# EAGLE design PROTOTYPE4 (EAGLE 8.2.2)
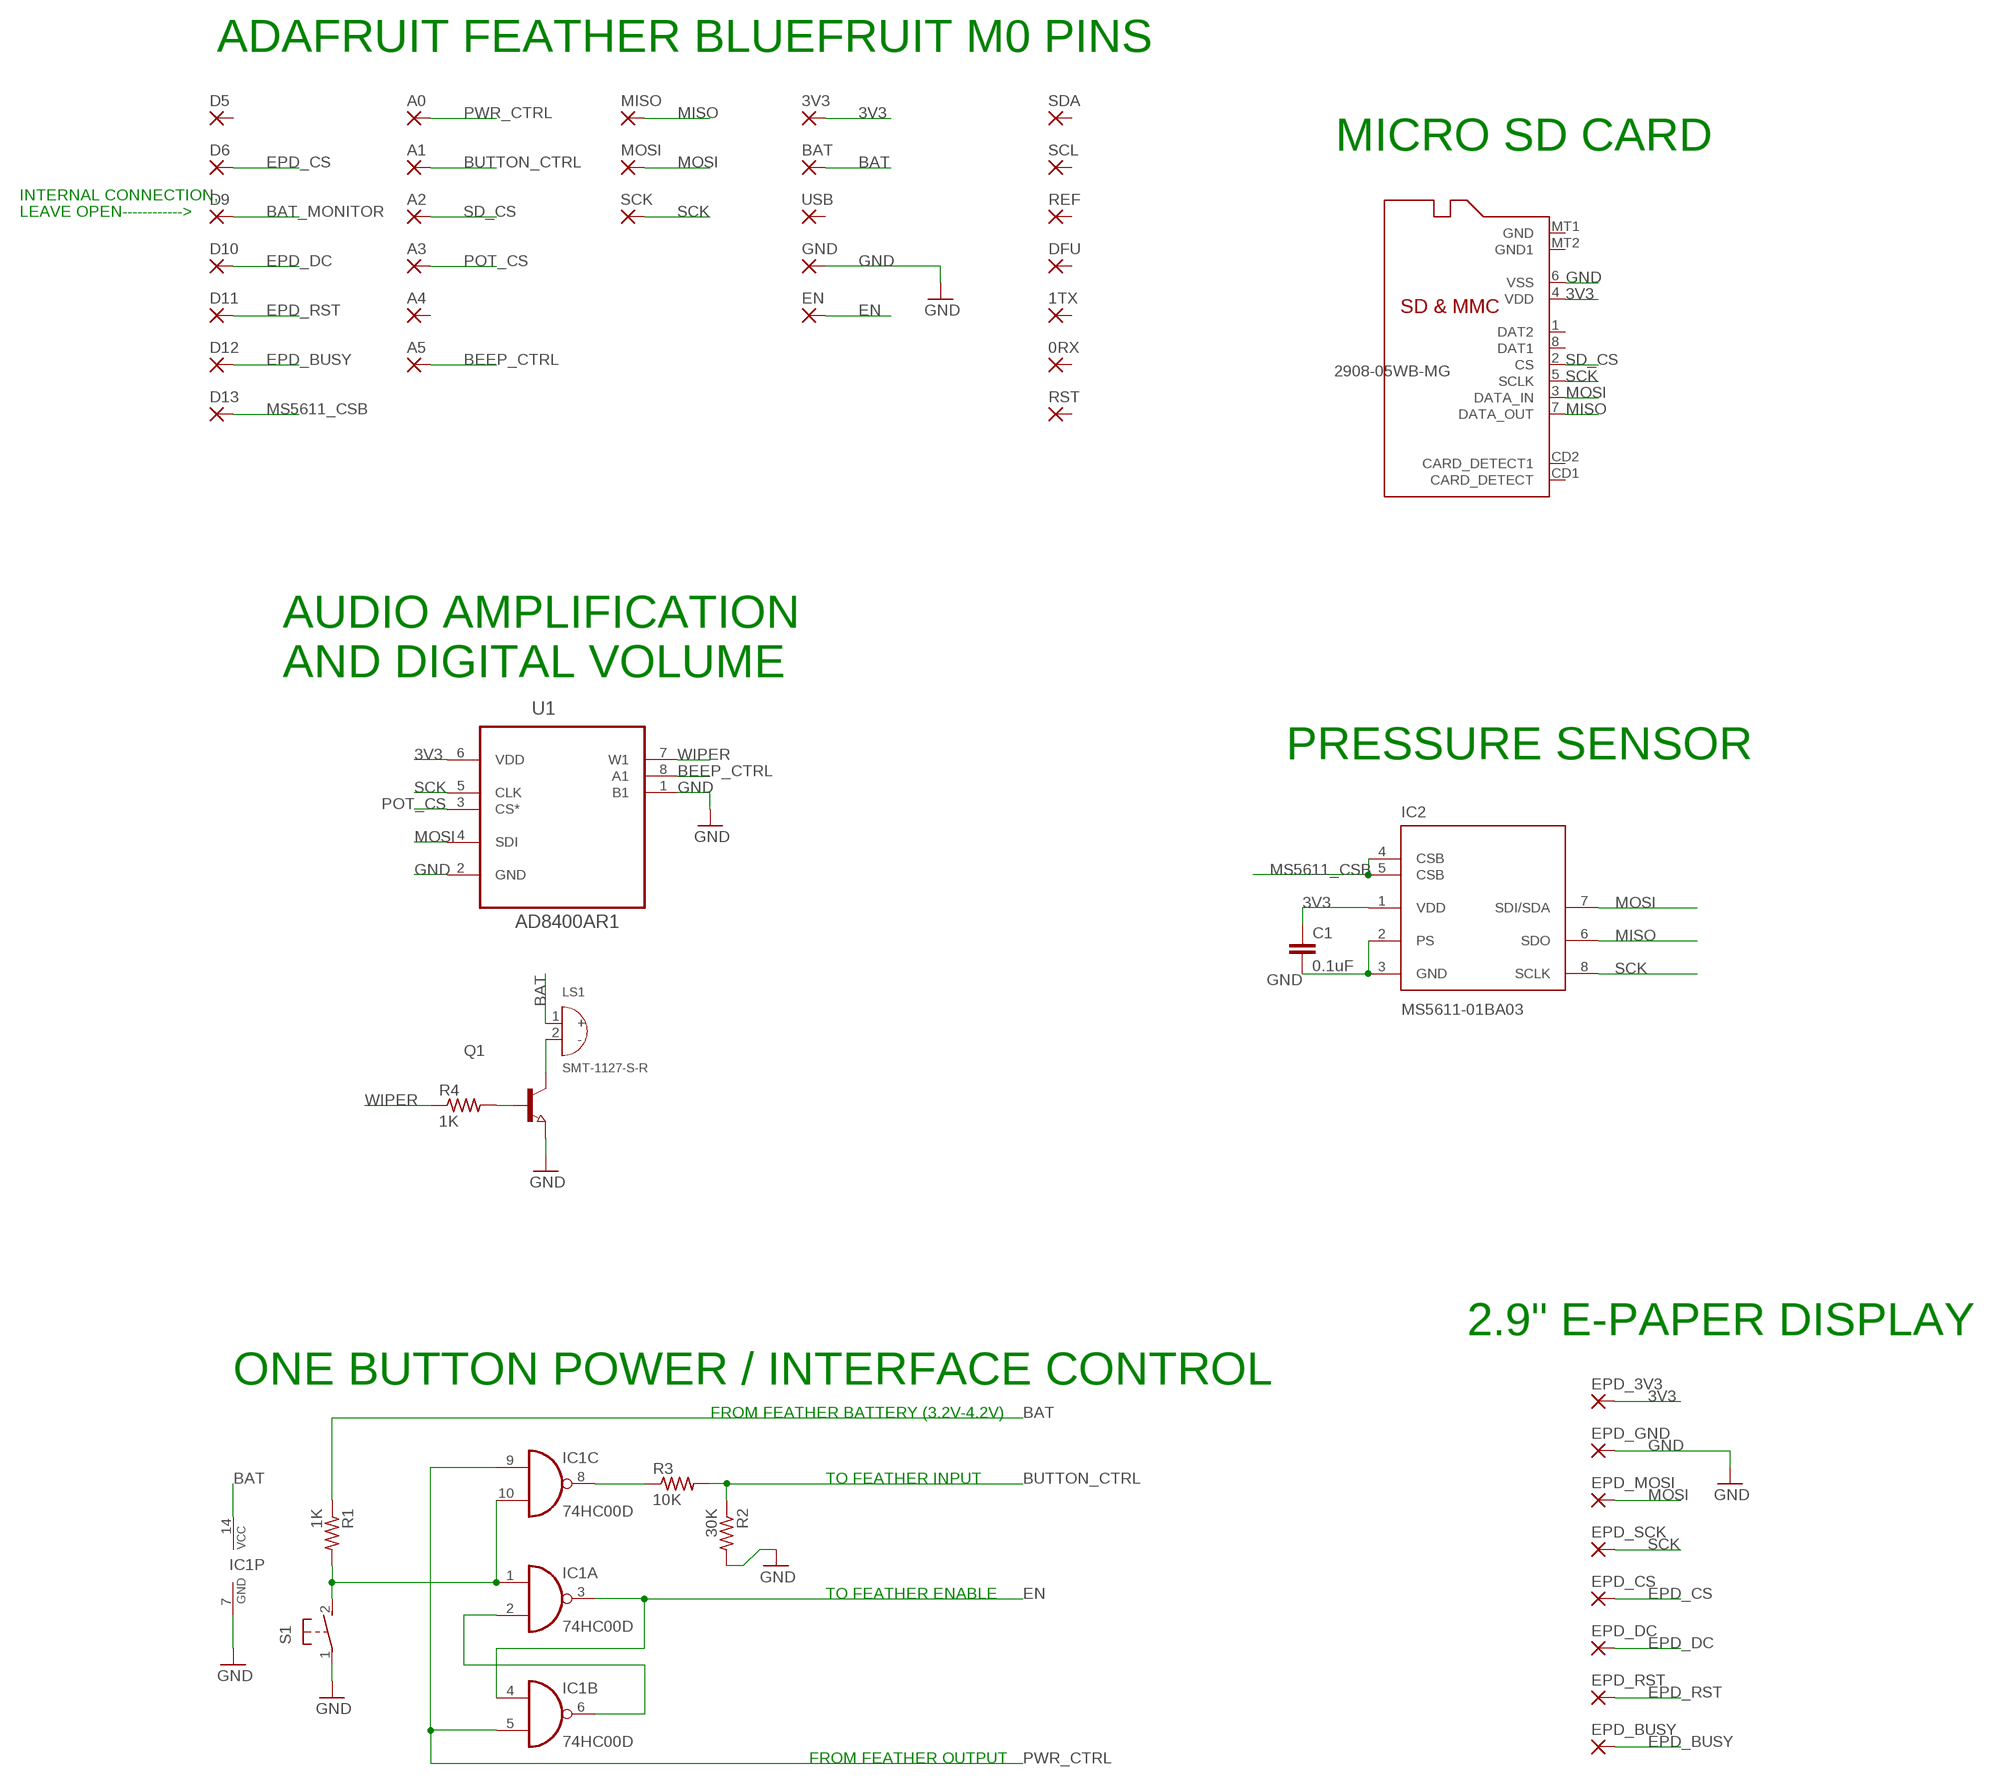
[diagram p0: schematic, sheet 1]

## Parts
0RX  SMD2  [SMD1,27-2,54]
1TX  SMD2  [SMD1,27-2,54]
3V3  SMD2  [SMD1,27-2,54]
A0  SMD2  [SMD1,27-2,54]
A1  SMD2  [SMD1,27-2,54]
A2  SMD2  [SMD1,27-2,54]
A3  SMD2  [SMD1,27-2,54]
A4  SMD2  [SMD1,27-2,54]
A5  SMD2  [SMD1,27-2,54]
BAT  SMD2  [SMD1,27-2,54]
C1  0.1uF  C-EUC0805K  [C0805K]
D5  SMD2  [SMD1,27-2,54]
D6  SMD2  [SMD1,27-2,54]
D9  SMD2  [SMD1,27-2,54]
D10  SMD2  [SMD1,27-2,54]
D11  SMD2  [SMD1,27-2,54]
D12  SMD2  [SMD1,27-2,54]
D13  SMD2  [SMD1,27-2,54]
DFU  SMD2  [SMD1,27-2,54]
EN  SMD2  [SMD1,27-2,54]
EPD_3V3  SMD2  [SMD1,27-2,54]
EPD_BUSY  SMD2  [SMD1,27-2,54]
EPD_CS  SMD2  [SMD1,27-2,54]
EPD_DC  SMD2  [SMD1,27-2,54]
EPD_GND  SMD2  [SMD1,27-2,54]
EPD_MOSI  SMD2  [SMD1,27-2,54]
EPD_RST  SMD2  [SMD1,27-2,54]
EPD_SCK  SMD2  [SMD1,27-2,54]
GND  SMD2  [SMD1,27-2,54]
IC1  74HC00D  [SO14]
IC2  MS5611-01BA03  MS5611-01BA03UNO  [SON125P300X500X100-8N]
LS1  SMT-1127-S-R  [XDCR_SMT-1127-S-R]
MISO  SMD2  [SMD1,27-2,54]
MOSI  SMD2  [SMD1,27-2,54]
Q1  NPN-TRANSISTOR_SOT23  [SOT23]
R1  1K  R-US_R0805  [R0805]
R2  30K  R-US_R0805  [R0805]
R3  10K  R-US_R0805  [R0805]
R4  1K  R-US_R0805  [R0805]
REF  SMD2  [SMD1,27-2,54]
RST  SMD2  [SMD1,27-2,54]
S1  31-XX  [B3F-31XX]
SCK  SMD2  [SMD1,27-2,54]
SCL  SMD2  [SMD1,27-2,54]
SDA  SMD2  [SMD1,27-2,54]
U1  AD8400AR1  [SOIC127P600X175-8N]
U$1  2908-05WB-MG  MICROSD  [MICROSD]
USB  SMD2  [SMD1,27-2,54]

## Nets
3V3: 3V3.1(P) C1.1 EPD_3V3.1(P) IC2.1(VDD) U1.6(VDD) U$1.4(VDD)
BAT: BAT.1(P) IC1.14(P:VCC) LS1.1(+) R1.1
BAT_MONITOR: D9.1(P)
BEEP_CTRL: A5.1(P) U1.8(A1)
BUTTON_CTRL: A1.1(P) R2.1 R3.2
EN: EN.1(P) IC1.3(A:O) IC1.4(B:I0)
EPD_BUSY: D12.1(P) EPD_BUSY.1(P)
EPD_CS: D6.1(P) EPD_CS.1(P)
EPD_DC: D10.1(P) EPD_DC.1(P)
EPD_RST: D11.1(P) EPD_RST.1(P)
GND: C1.2 EPD_GND.1(P) GND.1(P) IC1.7(P:GND) IC2.2(PS) IC2.3(GND) Q1.2(E) R2.2 S1.1(P) U1.1(B1) U1.2(GND) U$1.6(VSS)
MISO: IC2.6(SDO) MISO.1(P) U$1.7(DATA_OUT)
MOSI: EPD_MOSI.1(P) IC2.7(SDI/SDA) MOSI.1(P) U1.4(SDI) U$1.3(DATA_IN)
MS5611_CSB: D13.1(P) IC2.4(CSB) IC2.5(CSB)
N$1: IC1.1(A:I0) IC1.10(C:I1) R1.2 S1.2(S)
N$2: IC1.2(A:I1) IC1.6(B:O)
N$3: IC1.8(C:O) R3.1
N$7: Q1.1(B) R4.2
N$9: LS1.2(-) Q1.3(C)
POT_CS: A3.1(P) U1.3(CS*)
PWR_CTRL: A0.1(P) IC1.5(B:I1) IC1.9(C:I0)
SCK: EPD_SCK.1(P) IC2.8(SCLK) SCK.1(P) U1.5(CLK) U$1.5(SCLK)
SD_CS: A2.1(P) U$1.2(CS)
WIPER: R4.1 U1.7(W1)
Unconnected: 0RX.1(P) 1TX.1(P) A4.1(P) D5.1(P) DFU.1(P) IC1.11(D:O) IC1.12(D:I0) IC1.13(D:I1) REF.1(P) RST.1(P) SCL.1(P) SDA.1(P) U$1.1(DAT2) U$1.8(DAT1) U$1.CD1(CARD_DETECT) U$1.CD2(CARD_DETECT1) U$1.MT1(GND) U$1.MT2(GND1) USB.1(P)

## Notes on the sheet
- ADAFRUIT FEATHER BLUEFRUIT M0 PINS
- MICRO SD CARD
- INTERNAL CONNECTION,
- LEAVE OPEN------------>
- AUDIO AMPLIFICATION 
  AND DIGITAL VOLUME
- PRESSURE SENSOR
- 2.9" E-PAPER DISPLAY
- ONE BUTTON POWER / INTERFACE CONTROL
- FROM FEATHER BATTERY (3.2V-4.2V)
- TO FEATHER INPUT
- TO FEATHER ENABLE
- FROM FEATHER OUTPUT

## Library data of the parts
0RX 1TX 3V3 A0 A1-A5 BAT D5 D6 D9-D13 DFU EN EPD_3V3 EPD_BUSY EPD_CS EPD_DC EPD_GND EPD_MOSI EPD_RST EPD_SCK GND MISO MOSI REF RST SCK SCL SDA USB = wirepad:SMD2: SMD PAD
C1 = rcl:C-EU: CAPACITOR, European symbol
IC1 = 74xx-eu:74*00: Quad 2-input NAND gate
IC2 = Measurement-Specialties:MS5611-01BA03: Variometer Module, with stainless steel cap
LS1 = SMT-1127-S-R:SMT-1127-S-R: Audio Indicator Transducer Electromagnetic 3.6Vpk 100mA Solder Pad 2.5Vpk 2231Hz to 3231Hz Surface Mount; AVAILABILITY: Good; DESCRIPTION: Black Passive Electromagnetic SMD Buzzer 3V 80mA 2700Hz 92dB 9x3.2mm; MF: PUI Audio; MP: BOT-03D-BUJEON, SMT-1127-S-R; PACKAGE: None; PRICE: 1.43 USD
Q1 = semicon-smd-ipc:NPN-TRANSISTOR_: NPN TRANSISTOR
R1-R3 = adafruit:R-US_: RESISTOR, American symbol
R4 = resistor:R-US_: RESISTOR, American symbol
S1 = switch-omron:31-XX: OMRON SWITCH; MPN: B3F-3120; OC_FARNELL: 959704; OC_NEWARK: 36M3582
U1 = AD8400AR1:AD8400AR1: Digital Potentiometers; AVAILABILITY: Good; DESCRIPTION: Digital Potentiometer 256POS 1kOhm Single 8-Pin SOIC N Tube; MF: Analog Devices; MP: AD8400ARZ1; PACKAGE: SOIC-8 Analog Devices; PRICE: 2.43 USD
U$1 = adafruit:MICROSD: Micro-SD / Transflash card holder with SPI pinout For the 3M # 2908-05WB-MG and/or 4UCON #19656 push-push type; ACTUAL_PART_NUMBER: 2908-05WB-MG; KEEP_IN_MIND_ALTERNATE_PACKAGE: 5031821852

## Board
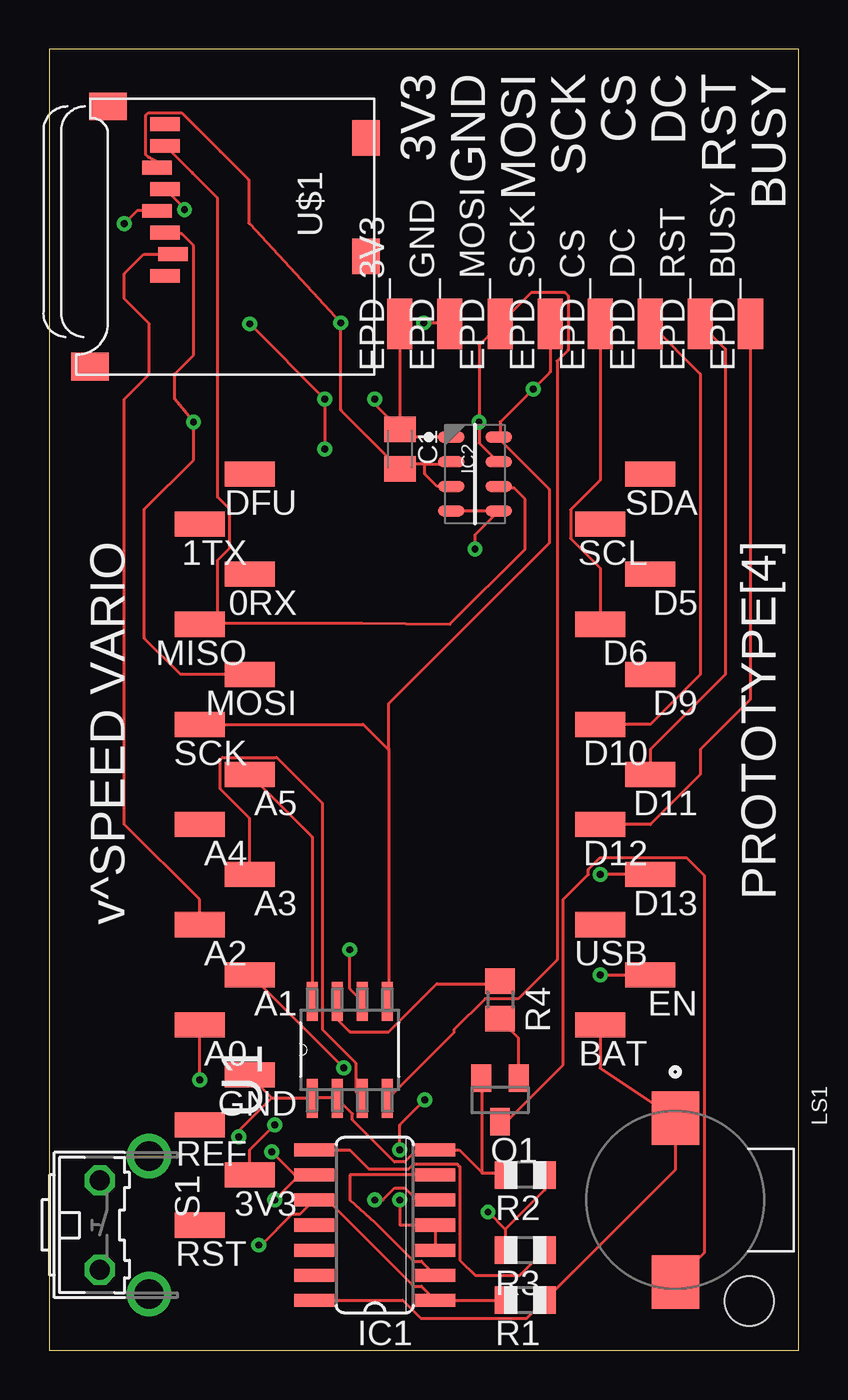
[diagram p1: board, top side]
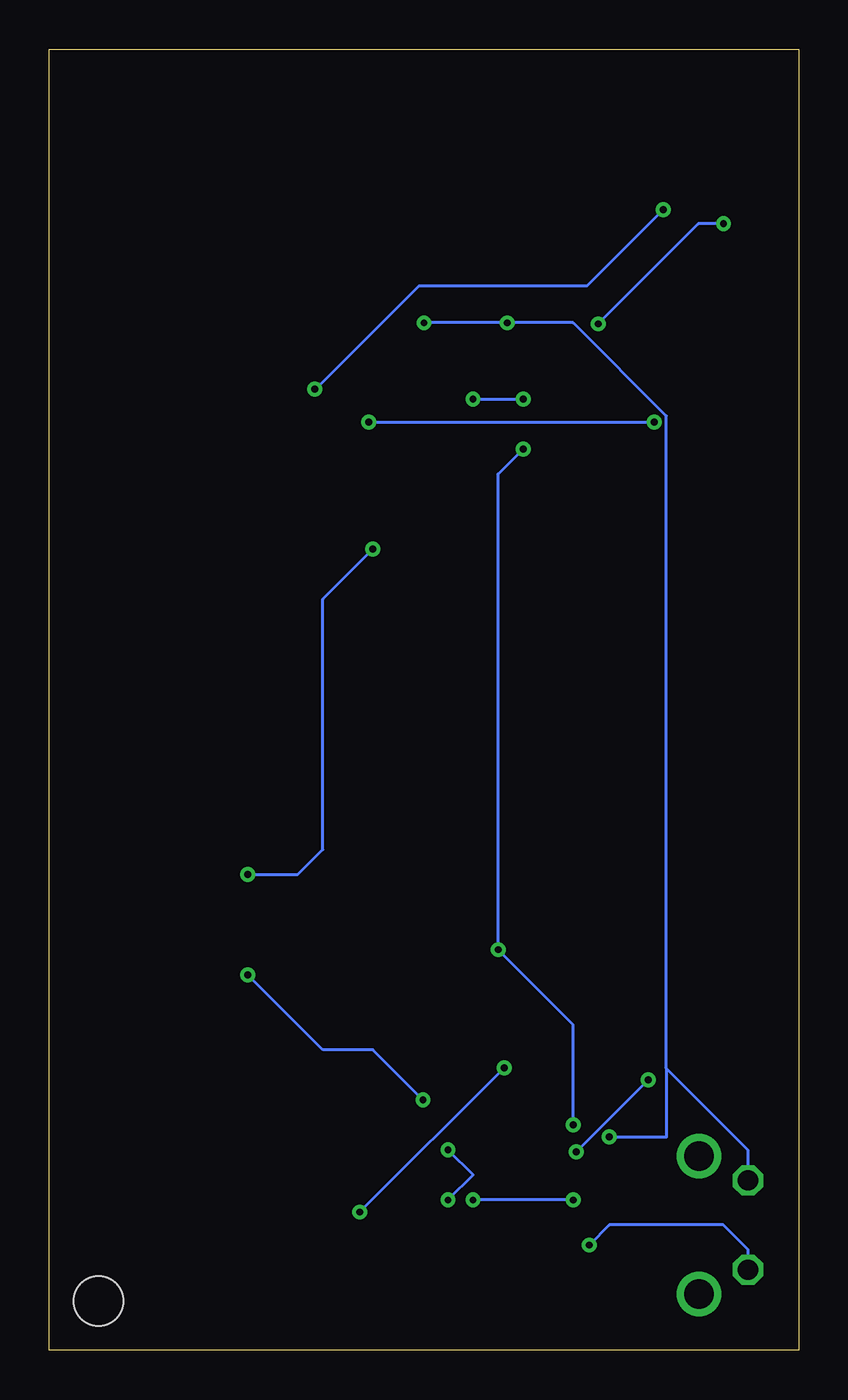
[diagram p2: board, bottom side, seen from below]

Size 38 x 66 mm. Coordinates in mm from the lower left corner, seen from the top.
Outline: 0,0 38,0 38,66 0,66 0,0
Copper layers (1*16): Top 0.035mm / dielectric 1.5mm / Bottom 0.035mm
Design rules "default": minimum track width 6mil, minimum drill 0.35mm, track to track 6mil, track to pad 6mil, pad to pad 6mil, via to via 6mil, smd to smd 6mil, copper to edge 40mil, drill to drill 6mil, minimum pad ring 10mil, minimum via ring 8mil, stop-mask expansion 4mil, vias tented up to drill 0mil, thermal gap 10mil
Holes 2.5 mm at 35.5,2.5

### Footprints (pad centres in the part's own frame; a part is rotated, then mirrored left to right if it is on the bottom)
SMD1,27-2,54 = smd 1.27 x 2.54: 1 0,0
C0805K = smd 1.3 x 1.6: 1 -1,0; 2 1,0
SO14 = smd 0.66 x 2.032: 1 -3.81,-3.073; 2 -2.54,-3.073; 3 -1.27,-3.073; 4 0,-3.073; 5 1.27,-3.073; 6 2.54,-3.073; 7 3.81,-3.073; 8 3.81,3.073; 9 2.54,3.073; 10 1.27,3.073; 11 0,3.073; 12 -1.27,3.073; 13 -2.54,3.073; 14 -3.81,3.073
SON125P300X500X100-8N = smd 1.35 x 0.55: 1 -1.2,1.875; 2 -1.2,0.625; 3 -1.2,-0.625; 4 -1.2,-1.875; 5 1.2,-1.875; 6 1.2,-0.625; 7 1.2,0.625; 8 1.2,1.875
XDCR_SMT-1127-S-R = smd 2.71 x 2.41: 1 -4.15,0; 2 4.15,0
SOT23 = smd 1 x 1.4: 1 -0.95,-1.1; 2 0.95,-1.1; 3 0,1.1
R0805 = smd 1.1 x 1.4: 1 -1,0; 2 1,0
R0805' = smd 1.3 x 1.5: 1 -0.95,0; 2 0.95,0
B3F-31XX = drill 1.016 octagon: 1 -2.261,-1.245; 2 2.261,-1.245 | drill 1.499 pad 2.159: 3 -3.505,1.245; 4 3.505,1.245
SOIC127P600X175-8N = smd 1.981 x 0.559: 1 -2.464,1.905; 2 -2.464,0.635; 3 -2.464,-0.635; 4 -2.464,-1.905; 5 2.464,-1.905; 6 2.464,-0.635; 7 2.464,0.635; 8 2.464,1.905
MICROSD = smd 0.7 x 1.5: 1 9,-10.64; 2 7.9,-10.24; 3 6.8,-10.64; 4 5.7,-11.04; 5 4.6,-10.64; 6 3.5,-11.04; 7 2.4,-10.64; 8 1.3,-10.64 | smd 1.8 x 1.4: CD1 2,-0.44; CD2 8,-0.44 | smd 1.4 x 1.9: MT1 0.4,-13.54; MT2 13.6,-14.44

### Placement (x,y rotation side)
0RX  10.16,39.37 90 top
1TX  7.62,41.91 90 top
3V3  10.16,8.89 90 top
A0  7.62,16.51 90 top
A1  10.16,19.05 90 top
A2  7.62,21.59 90 top
A3  10.16,24.13 90 top
A4  7.62,26.67 90 top
A5  10.16,29.21 90 top
BAT  27.94,16.51 90 top
C1  17.78,45.72 270 top
D5  30.48,39.37 90 top
D6  27.94,36.83 90 top
D9  30.48,34.29 90 top
D10  27.94,31.75 90 top
D11  30.48,29.21 90 top
D12  27.94,26.67 90 top
D13  30.48,24.13 90 top
DFU  10.16,44.45 90 top
EN  30.48,19.05 90 top
EPD_3V3  17.78,52.07 0 top
EPD_BUSY  35.56,52.07 0 top
EPD_CS  27.94,52.07 0 top
EPD_DC  30.48,52.07 0 top
EPD_GND  20.32,52.07 0 top
EPD_MOSI  22.86,52.07 0 top
EPD_RST  33.02,52.07 0 top
EPD_SCK  25.4,52.07 0 top
GND  10.16,13.97 90 top
IC1  16.51,6.35 90 top
IC2  21.59,44.45 0 top
LS1  31.75,7.62 270 top
MISO  7.62,36.83 90 top
MOSI  10.16,34.29 90 top
Q1  22.86,12.7 180 top
R1  24.13,2.54 180 top
R2  24.13,8.89 180 top
R3  24.13,5.08 180 top
R4  1K  [R0805']  22.86,17.78 270 top
REF  7.62,11.43 90 top
RST  7.62,6.35 90 top
S1  3.81,6.35 270 top
SCK  7.62,31.75 90 top
SCL  27.94,41.91 90 top
SDA  30.48,44.45 90 top
U1  15.24,15.24 90 top
U$1  16.51,63.5 270 top
USB  27.94,21.59 90 top

### Tracks (layer width: path | path; a pad name or v marks a point on that pad's centre or on a via)
3V3  (via drill 0.35)
  Top 0.152: C1.1 17.81,46.75 18.23,46.33 IC2.1 | 10.67,9.4 3V3.1 10.16,10.16 v11.43,11.43 | v15.24,20.32 15.24,18.34 U1.6 | v13.97,45.72 v13.97,48.26 v10.16,52.07 | v16.51,48.26 16.51,47.99 C1.1 | EPD_3V3.1 C1.1 | U$1.4 4.46,57.8 v3.81,57.15
  Bottom 0.152: v13.97,45.72 15.24,44.45 v15.24,20.32 11.43,16.51 v11.43,11.43 | v16.51,48.26 v13.97,48.26 | v3.81,57.15 5.08,57.15 v10.16,52.07
BAT
  Top 0.152: BAT.1 27.94,14.31 LS1.1 31.75,9.16 25.49,2.9 R1.1 24.2,1.61 18.84,1.61 17.91,2.54 IC1.14
BEEP_CTRL
  Top 0.152: 10.21,29.11 A5.1 13.34,26.04 U1.8
BUTTON_CTRL  (via drill 0.35)
  Top 0.152: v14.94,14.33 10.21,19.05 A1.1 | v22.25,7.01 23.13,6.13 | 23.13,6.13 R3.2 | 23.13,6.13 25.13,8.13 R2.1
  Bottom 0.152: v22.25,7.01 v14.94,14.33
EN  (via drill 0.35)
  Top 0.152: v17.78,10.16 17.78,11.43 v19.05,12.7 | v27.94,19.05 EN.1 | IC1.3 IC1.4 17.78,6.35 v17.78,7.62
  Bottom 0.152: v19.05,12.7 21.59,15.24 24.13,15.24 v27.94,19.05 | v17.78,10.16 16.51,8.89 v17.78,7.62
EPD_BUSY
  Top 0.152: EPD_BUSY.1 35.56,33.02 33.02,30.48 33.02,29.21 30.48,26.67 D12.1
EPD_CS
  Top 0.152: EPD_CS.1 27.94,44.14 26.44,42.64 26.44,41.18 27.94,39.68 D6.1
EPD_DC
  Top 0.152: EPD_DC.1 33.02,49.53 33.02,34.29 30.48,31.75 D10.1
EPD_RST
  Top 0.152: EPD_RST.1 34.29,50.8 34.29,34.29 30.48,30.48 D11.1
GND  (via drill 0.35)
  Top 0.152: R2.2 23.01,8.99 21.95,8.99 | 21.95,8.99 21.95,13.72 Q1.2 | 14.58,12.78 U1.2 14.63,12.65 14.63,12.34 | 14.58,12.78 14.48,12.8 13.41,12.8 U1.1 13.26,12.8 11.28,12.8 | 11.28,12.8 10.21,13.87 GND.1 | v9.6,10.82 9.6,11.12 11.28,12.8 | 20.42,43.89 IC2.3 19.68,43.83 19.05,44.45 19.05,44.92 19.02,44.96 | 20.42,44.96 IC2.2 20.27,44.96 19.02,44.96 | 19.02,44.96 17.98,44.96 17.83,44.81 C1.2 17.68,44.81 14.78,47.7 v14.78,52.12 10.16,57.15 10.11,57.2 10.11,59.38 8.66,60.83 6.71,62.78 5.03,62.78 4.89,62.65 4.89,60.66 5.03,60.52 5.59,60.23 U$1.6 | 14.58,12.78 15.37,11.99 15.37,11.69 17.5,9.55 18.03,9.55 18.64,10.16 IC1.7 20.78,10.16 21.95,8.99 | v19,52.12 20.27,52.12 EPD_GND.1
  Bottom 0.152: v9.6,10.82 6.71,10.82 6.71,14.29 | 6.71,14.29 6.71,47.4 11.43,52.12 v14.78,52.12 v19,52.12 | S1.1 2.56,10.15 6.71,14.29
MISO
  Top 0.152: 8.53,36.88 7.62,36.88 MISO.1 8.53,36.88 | 8.53,36.88 15.85,36.88 20.32,36.83 24.13,40.64 24.13,43.18 23.57,43.74 22.71,43.74 IC2.6 | 7.26,59.71 7.26,59.74 | 8.53,36.88 8.53,40.08 9.14,40.69 9.14,42.67 8.53,43.28 8.53,58.44 7.26,59.71 | 7.26,59.71 U$1.7
MOSI  (via drill 0.35)
  Top 0.152: MOSI.1 6.66,34.29 4.83,36.12 4.83,42.67 7.32,45.16 v7.32,47.09 6.35,48.26 6.35,49.53 7.32,50.49 7.32,56.03 6.71,56.64 5.94,56.64 U$1.3 | IC2.7 22.71,45.11 21.79,46.02 v21.79,47.09 21.79,51 EPD_MOSI.1 24.43,53.65 26.16,53.65 26.31,53.49 26.31,50.75 25.76,50.19 25.76,19.81 23.77,17.83 22.1,17.83 20.52,16.26 20.52,16.1 17.22,12.8 U1.4
  Bottom 0.152: v21.79,47.09 v7.32,47.09
MS5611_CSB  (via drill 0.35)
  Top 0.152: IC2.4 IC2.5 21.59,41.38 v21.59,40.64 | D13.1 v27.94,24.13
  Bottom 0.152: v27.94,24.13 25.4,24.13 24.13,25.4 24.13,38.1 v21.59,40.64
N$1  (via drill 0.35)
  Top 0.152: v10.62,5.33 10.75,5.33 12.33,6.91 12.72,6.91 IC1.10 14.1,7.62 18.47,3.25 18.87,3.25 IC1.1 R1.2
  Bottom 0.152: S1.2 2.56,5.11 3.81,6.35 9.6,6.35 v10.62,5.33
N$2
  Top 0.152: IC1.6 15.24,8.89 15.24,7.62 16.51,6.48 18.47,4.52 18.87,4.52 IC1.2
N$3
  Top 0.152: R3.1 23.86,3.81 21.59,3.81 20.83,4.57 20.83,5.5 20.8,5.9 20.83,5.92 20.83,9.31 20.69,9.45 18.47,9.45 18.22,9.2 16.2,9.2 15.24,10.16 IC1.8
N$7
  Top 0.152: Q1.1 23.77,13.87 23.77,15.85 22.86,16.76 R4.2
N$9
  Top 0.152: Q1.3 22.86,11.73 23.32,11.73 26.06,14.48 26.06,22.86 27.33,24.13 27.33,24.38 27.95,24.99 32.31,24.99 33.22,24.08 33.22,4.94 LS1.2
POT_CS
  Top 0.152: U1.3 15.54,13.11 15.54,14.58 13.84,16.28 13.84,27.75 11.53,30.07 8.79,30.07 8.66,29.94 8.66,28.48 10.16,26.98 A3.1
PWR_CTRL  (via drill 0.35)
  Top 0.152: v7.62,13.72 A0.1 | v16.51,7.62 16.92,7.62 17.53,8.23 18.03,8.23 18.64,7.62 IC1.5 | v11.43,7.62 12.7,8.89 IC1.9 12.45,8.89 v11.28,10.06
  Bottom 0.152: v11.28,10.06 v7.62,13.72 | v11.43,7.62 v16.51,7.62
SCK  (via drill 0.35)
  Top 0.152: 17.07,17.22 17.07,17.68 U1.5 17.22,17.83 17.22,30.45 | 7.62,31.7 SCK.1 15.92,31.75 17.22,30.45 | EPD_SCK.1 25.4,49.63 v24.54,48.77 22.86,47.09 22.86,46.33 IC2.8 22.86,46.18 25.35,43.69 25.35,40.95 17.22,32.82 17.22,30.52 | 17.22,30.45 17.22,30.52 | v6.86,57.86 6.86,57.91 U$1.5 | 17.18,30.48 17.22,30.52
  Bottom 0.152: v6.86,57.86 10.72,54 19.25,54 24.48,48.77 v24.54,48.77
SD_CS
  Top 0.152: 7.62,21.64 A2.1 7.62,22.86 3.81,26.67 3.81,48.26 5.08,49.53 5.08,52.07 3.81,53.34 3.81,54.61 4.8,55.6 U$1.2
WIPER
  Top 0.152: R4.1 22.86,18.59 19.66,18.59 17.22,16.15 15.24,16.15 14.63,16.76 14.63,17.68 U1.7

### Text on the board
tPlace: 3V3 | GND | MOSI | SCK | CS | DC | RST | BUSY | PROTOTYPE[4] | v^SPEED VARIO